# EAGLE design EEPROM_breakout (EAGLE 6.4)
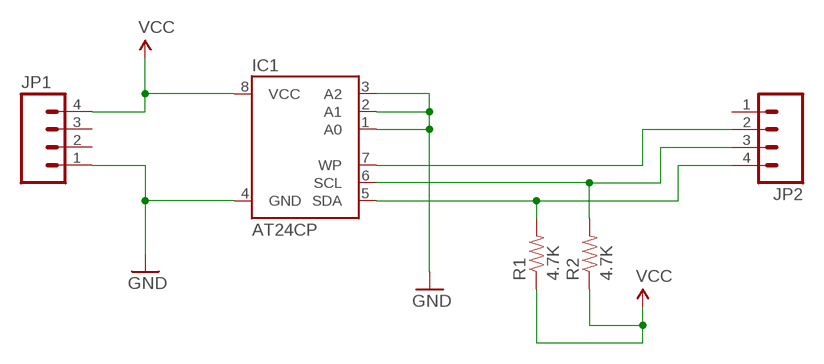
[diagram p0: schematic, sheet 1]

## Parts
IC1  AT24CP  [DIL08]
JP1  M04LOCK  [1X04_LOCK]
JP2  M04LOCK  [1X04_LOCK]
R1  4.7K  RESISTORPTH-1/4W  [AXIAL-0.4]
R2  4.7K  RESISTORPTH-1/4W  [AXIAL-0.4]

## Nets
GND: IC1.1(A0) IC1.2(A1) IC1.3(A2) IC1.4(GND) JP1.1
N$4: IC1.5(SDA) JP2.4 R1.P$2
N$5: IC1.6(SCL) JP2.3 R2.P$2
N$6: IC1.7(WP) JP2.2
VCC: IC1.8(VCC) JP1.4 R1.P$1 R2.P$1
Unconnected: JP1.2 JP1.3 JP2.1

## Library data of the parts
IC1 = EEPROM:AT24C*: 2-wire serial EEPROM; MPN: AT24C1024BW-SH-B; OC_FARNELL: 1362646; OC_NEWARK: 03P2044
JP1 JP2 = SparkFun-Connectors:M04: Header 4 Standard 4-pin 0.1" header. Use with straight break away headers (SKU : PRT-00116), right angle break away headers (PRT-00553), swiss pins (PRT-00743), machine pins (PRT-00117), and female headers (PRT-00115). Molex polarized connector foot print use with SKU : PRT-08231 with associated crimp pins and housings. 1MM SMD Version SKU: PRT-10208
R1 R2 = SparkFun-Resistors:RESISTOR: Resistor Basic schematic elements and footprints for 0603, 1206, and PTH resistors.

## Board
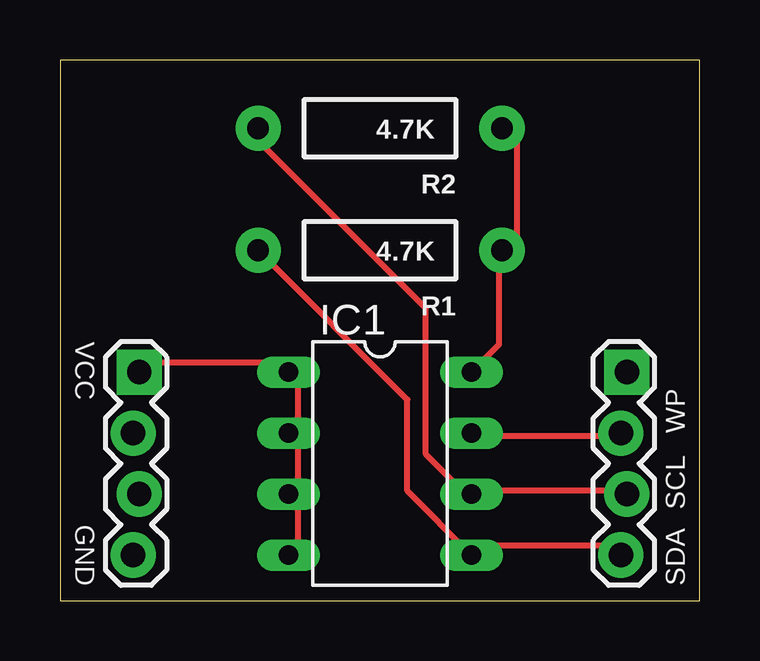
[diagram p1: board, top side]
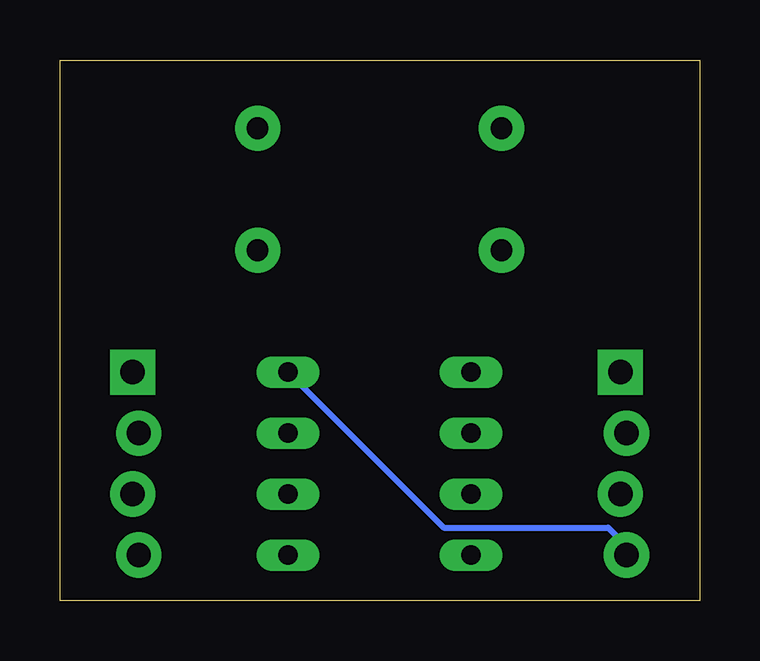
[diagram p2: board, bottom side, seen from below]

Size 26.65 x 22.53 mm. Coordinates in mm from the lower left corner, seen from the top.
Outline: 0,0 26.65,0 26.65,22.53 0,22.53 0,0
Copper layers (1*16): Top 0.035mm / dielectric 1.5mm / Bottom 0.035mm
Design rules "default": minimum track width 10mil, minimum drill 24mil, track to track 8mil, track to pad 8mil, pad to pad 8mil, via to via 8mil, smd to smd 8mil, copper to edge 40mil, drill to drill 8mil, minimum pad ring 10mil, minimum via ring 8mil, stop-mask expansion 4mil, vias tented up to drill 0mil, thermal gap 10mil

### Footprints (pad centres in the part's own frame; a part is rotated, then mirrored left to right if it is on the bottom)
DIL08 = drill 0.813 long: 1 -3.81,-3.81; 2 -1.27,-3.81; 3 1.27,-3.81; 4 3.81,-3.81; 5 3.81,3.81; 6 1.27,3.81; 7 -1.27,3.81; 8 -3.81,3.81
1X04_LOCK = drill 1.016 pad 1.88 square: 1 0,0.127 | drill 1.016 pad 1.88: 2 2.54,-0.127; 3 5.08,0.127; 4 7.62,-0.127
AXIAL-0.4 = drill 0.9 pad 1.88: P$1 -5.08,0; P$2 5.08,0

### Placement (x,y rotation side)
IC1  13.34,5.71 270 top
JP1  3.17,9.53 270 top
JP2  23.5,9.53 270 top
R1  13.34,14.61 180 top
R2  13.34,19.68 180 top

### Tracks (layer width: path | path; a pad name or v marks a point on that pad's centre or on a via)
GND
  Top 0.254: IC1.4 9.91,2.29 9.91,3.81 IC1.3 9.91,4.57 9.91,6.86 IC1.2 9.91,7.62 9.91,9.14 IC1.1 9.14,9.91 3.81,9.91 JP1.1
N$4
  Top 0.254: JP2.4 22.86,2.29 17.53,2.29 IC1.5 14.48,4.57 14.48,8.38 R1.P$2
N$5
  Top 0.254: JP2.3 23.62,4.57 17.53,4.57 IC1.6 16.76,4.57 15.24,6.1 15.24,12.19 8.38,19.05 R2.P$2
N$6
  Top 0.254: IC1.7 17.53,6.86 22.86,6.86 JP2.2
VCC
  Top 0.254: IC1.8 18.29,10.67 18.29,14.48 R1.P$1 19.05,15.24 19.05,19.05 R2.P$1
  Bottom 0.254: IC1.8 10.67,3.05 3.81,3.05 3.05,2.29 JP1.4

### Text on the board
tPlace: VCC | WP | SCL | GND | SDA